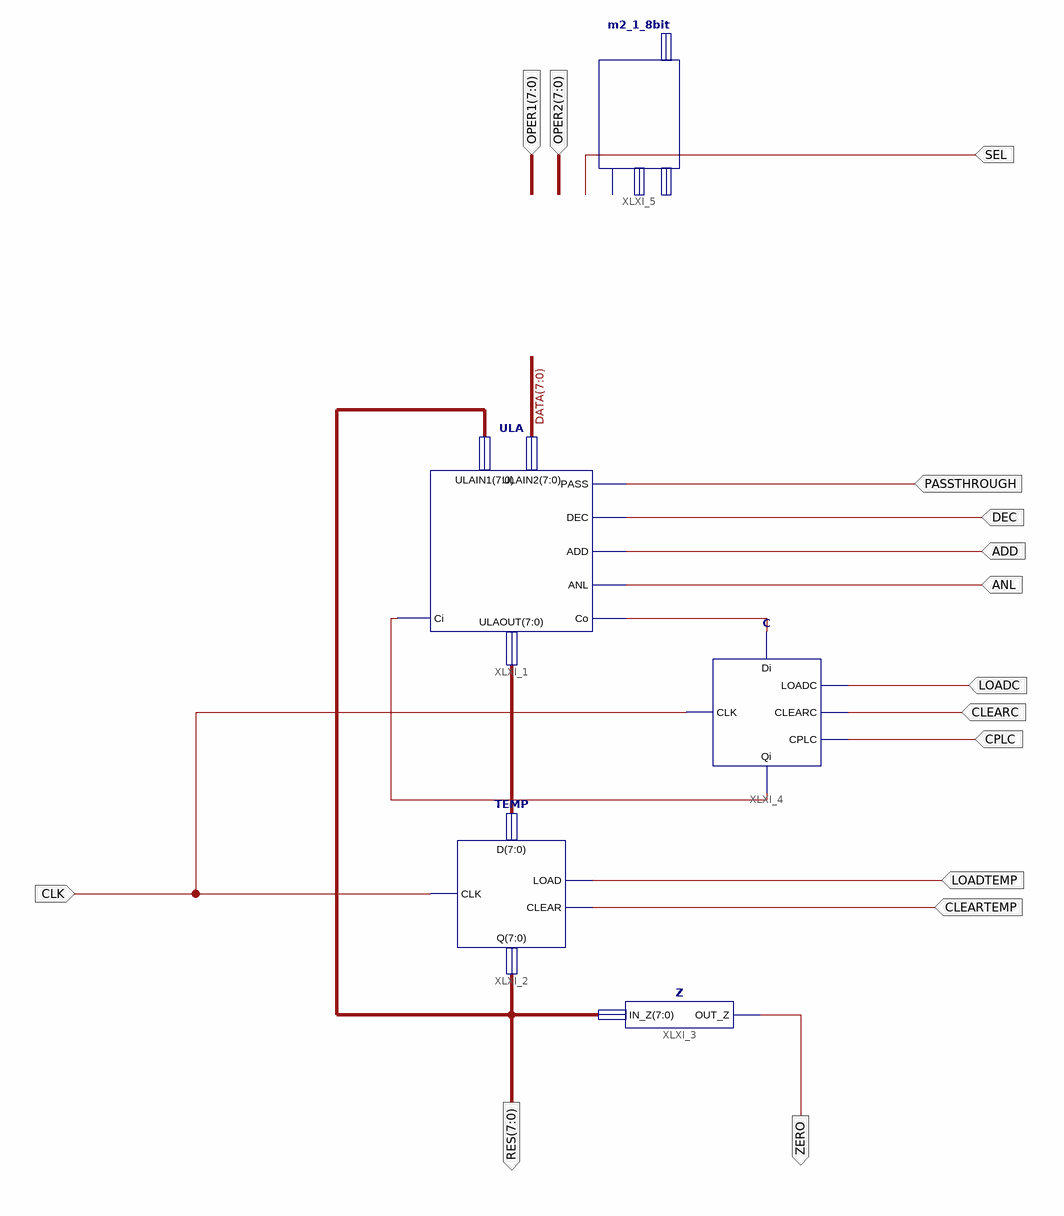
[diagram p0: schematic sheet 1]
// Xilinx ISE schematic Dados.sch (spartan3e) as structural Verilog: 5 symbols, 15 ports
module Dados (
  input  CLK,
  input  LOADTEMP,
  input  CLEARTEMP,
  input  ANL,
  input  ADD,
  input  DEC,
  input  PASSTHROUGH,
  input  LOADC,
  input  CLEARC,
  input  CPLC,
  input  SEL,
  input  [7:0] OPER1,
  input  [7:0] OPER2,
  output ZERO,
  output [7:0] RES
);

  wire XLXN_42, XLXN_43;
  wire [7:0] DATA, XLXN_1;

  TEMP XLXI_2 (.Q(RES), .CLK(CLK), .LOAD(LOADTEMP), .CLEAR(CLEARTEMP), .D(XLXN_1));
  Z XLXI_3 (.IN_Z(RES), .OUT_Z(ZERO));
  ULA XLXI_1 (
    .PASS(PASSTHROUGH), .DEC(DEC), .ADD(ADD), .ANL(ANL), .Co(XLXN_42), .ULAOUT(XLXN_1), .ULAIN2(DATA),
    .ULAIN1(RES), .Ci(XLXN_43));
  C XLXI_4 (.CLEARC(CLEARC), .Di(XLXN_42), .CLK(CLK), .Qi(XLXN_43), .CPLC(CPLC), .LOADC(LOADC));
  m2_1_8bit XLXI_5 (.D0(OPER1), .D1(OPER2), .O(DATA), .S0(SEL));
endmodule
